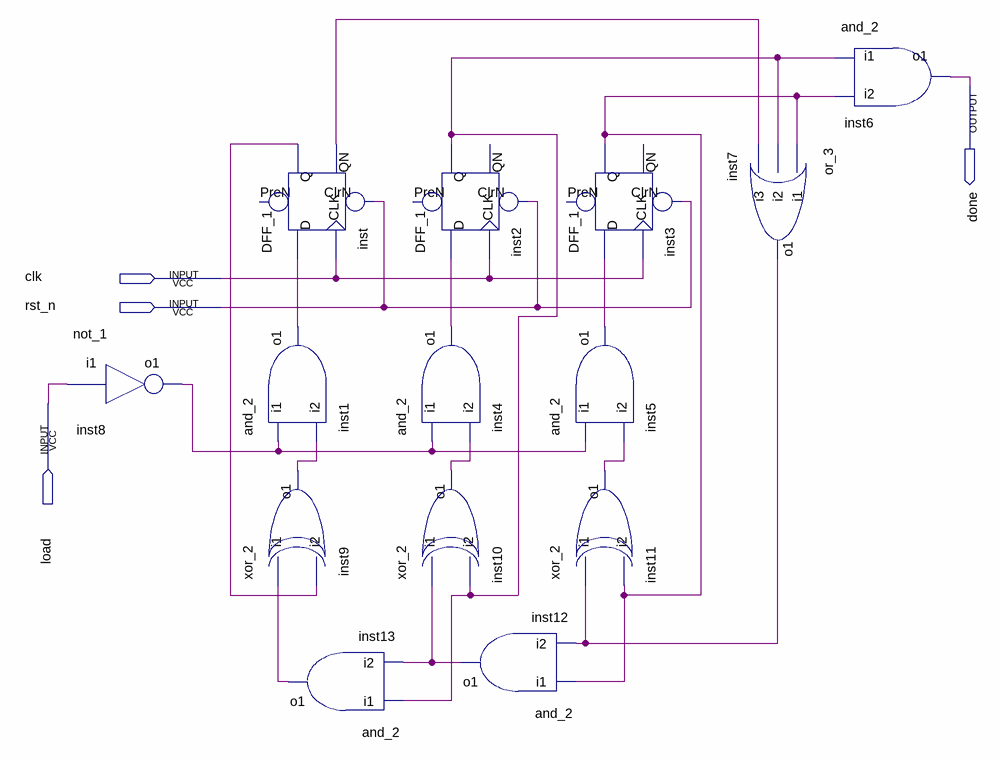
[diagram p0: schematic sheet]
// Quartus schematic FSM.bdf as structural Verilog: 14 symbols, 4 pins
module FSM (
  input  clk,
  input  rst_n,
  input  load,
  output done
);

  wire inst1_o1, inst2_q, inst3_q, inst4_o1, inst5_o1, inst7_o1, inst8_o1, inst9_o1, inst10_o1, inst11_o1,
       inst12_o1, inst13_o1, inst_q, inst_qn;

  not_1 inst8 (.i1(load), .o1(inst8_o1));
  DFF_1 inst (.CLK(clk), .D(inst1_o1), .ClrN(rst_n), .QN(inst_qn), .Q(inst_q));  // open: PreN
  and_2 inst1 (.i1(inst8_o1), .i2(inst9_o1), .o1(inst1_o1));
  xor_2 inst9 (.i1(inst13_o1), .i2(inst_q), .o1(inst9_o1));
  and_2 inst13 (.i1(inst2_q), .i2(inst12_o1), .o1(inst13_o1));
  DFF_1 inst2 (.CLK(clk), .D(inst4_o1), .ClrN(rst_n), .Q(inst2_q));  // open: PreN, QN
  and_2 inst4 (.i1(inst8_o1), .i2(inst10_o1), .o1(inst4_o1));
  xor_2 inst10 (.i1(inst12_o1), .i2(inst2_q), .o1(inst10_o1));
  and_2 inst12 (.i1(inst3_q), .i2(inst7_o1), .o1(inst12_o1));
  DFF_1 inst3 (.CLK(clk), .D(inst5_o1), .ClrN(rst_n), .Q(inst3_q));  // open: PreN, QN
  and_2 inst5 (.i1(inst8_o1), .i2(inst11_o1), .o1(inst5_o1));
  xor_2 inst11 (.i1(inst7_o1), .i2(inst3_q), .o1(inst11_o1));
  or_3 inst7 (.i1(inst3_q), .i2(inst2_q), .i3(inst_qn), .o1(inst7_o1));
  and_2 inst6 (.i1(inst2_q), .i2(inst3_q), .o1(done));
endmodule
